# Altium schematic sheet Sensors_Actuators.SchDoc
size A4; SheetNumber: 3; SheetTotal: 3
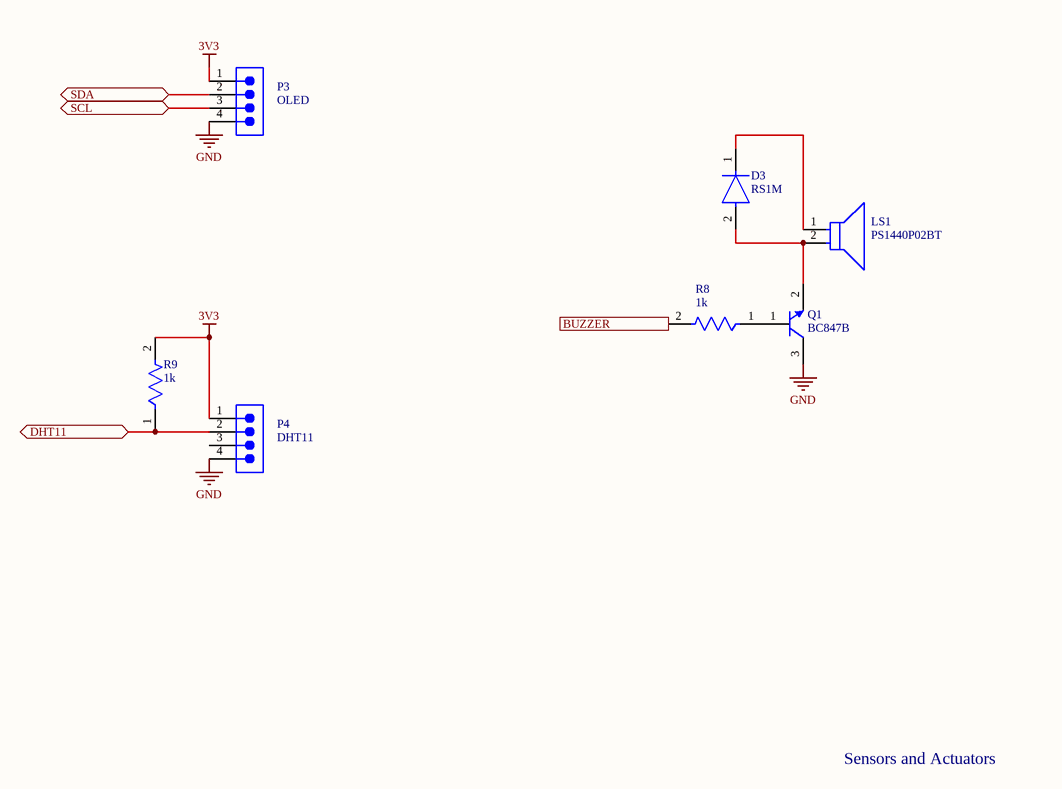
[diagram p0: Sensors_Actuators.SchDoc]

## Parts
D3  RS1M  [FP-403AE-MFG]
LS1  PS1440P02BT  [FP-PS1440P02BT-MFG]
P3  OLED  [61300411121]
P4  DHT11  [61300411121]
Q1  BC847B  [INF-SOT23_M]
R8  1k  [FP-CRCW1206-e3-MFG]
R9  1k  [FP-CRCW1206-e3-MFG]

## Ports
BUZZER (in, see Microcontroller[2B]), DHT11 (bidir, see Microcontroller[2B]), SCL (bidir, see Microcontroller[2B]), SDA (bidir, see Microcontroller[2B])

## Nets
3V3: P3.1 P4.1 R9.2
GND: P3.4 P4.4 Q1.3(C)
BUZZER: R8.2 ; port BUZZER
DHT11: P4.2 R9.1 ; port DHT11
SCL: P3.3 ; port SCL
SDA: P3.2 ; port SDA
NetD3_1: D3.1(C) LS1.1
NetD3_2: D3.2(A) LS1.2 Q1.2(E)
NetQ1_1: Q1.1(B) R8.1

Not connected (* = marked no-connect by the designer): P4 3

## Notes on the sheet
- Sensors and Actuators

## Library data of the parts
D3 = CMP-07163-000022-1: DIODE GEN PURP 1KV 1A SMA; Manufacturer: ON Semiconductor; Max Surge Forward Current: 30A; Max Repetitive Reverse Voltage: 1000V; Value: 10pF; Max Junction Temp: +150°C; Peak Reverse Current: 5uA; Standoff Height: 0.05mm; ComponentLink2URL: https://www.onsemi.com/pub/Collateral/RS1M-D.PDF; Footprint Url: https://www.onsemi.com/pub/Collateral/403AE.PDF; Mouser Description: On a Reel of 7500, ON Semi 1000V 1A, Diode, 2-Pin DO-214AC RS1M; Package: 403AE; Manufacturer Part Number: RS1M; Temperature Range Low: -55°C; Device Class L1: Discrete Semiconductors; Automotive: No; Height: 2.5mm; Octopart: https://octopart.com/rs1m-on+semiconductor-84331238; Digikey Description: DIODE GEN PURP 1KV 1A SMA; Temperature Range High: +150°C; Capacitance: 10pF; RoHS: TRUE; Device Class L2: Diodes; ComponentLink2Description: Datasheet; Temperature: -55°C to +150°C; Device Class L3: Rectifier Diodes; Forward Current: 1A; Lead Free: Yes; Category: Diode
LS1 = CMP-08413-000003-1: AUDIO PIEZO TRANSDUCER 30V TH; Self Resonant Frequency: 4kHz; Washable: No; Voltage Rating (DC): 3V; Number of Terminals/Pins: 2; Packaging: Tape and Reel; Lead Free: Lead Free; Min Operating Temperature: -10°C; Package Quantity: 350; Termination: PC Pins; Mount: Through Hole; Max Operating Temperature: 70°C; Operating Supply Voltage: 3V; Diameter: 14mm; RoHS Compliant: Yes; Frequency: 4kHz; Height: 8mm
P3 P4 = CMP-1502-01064-3: NexarPartId: 32855522; Operating Supply Voltage: 250V; Pitch: 2.54mm; Contact Resistance: 20mΩ; Number of Positions: 4; Current Rating: 3A; Connector Type: Male Pin; Gender: Male; Contact Plating: Gold; Height: 8.89mm; Lead Pitch: 2.54mm; Lead Free: Lead Free; Contact Mating Length: 5.9944mm; Number of Rows: 1; Termination: Solder; Packaging: Bulk; REACH SVHC: Unknown; Min Operating Temperature: -40°C; RoHS: Compliant; Number of Contacts: 4; Voltage Rating: 250V; Color: Black; Max Operating Temperature: 105°C; Contact Material: Copper; Mount: Through Hole; Orientation: Vertical; Number of Pins: 4
Q1 = CMP-1177-00042-1: NPN Silicon AF Transistor, 45 V VCEO, 100 mA IC, SOT23, Reel, Green; Manufacturer: Infineon; VEBO (max): 6Â V; ICBO (max): 15Â nA; VCBO (max): 50Â V; IBM (max): 200Â mA; Green: TRUE; Ptot (max): 330Â mW; fT (typ): 250Â MHz; IC (max): 100Â mA; VCEO (max): 45Â V; PackageDescription: 3-Pin Small Outline Transistor Package, 1.3 x 2.9 mm Body, 0.95 mm Pitch; ComponentLink3URL: http://www.infineon.com/dgdl/SOT23-Package_Overview.pdf?folderId=db3a30431936bc4b0119532290053c66&fileId=db3a30431936bc4b0119533468123c85; PackageVersion: Apr-08; Packing: Reel; ComponentLink3Description: Package Specification; ComponentLink2URL: http://www.infineon.com/dgdl/bc847series_bc848series_bc849series_bc850series.pdf?folderId=db3a304314dca389011541d30fa21656&fileId=db3a304314dca389011541d4630a1657; ComponentLink1URL: http://www.infineon.com/; ComponentLink2Description: Datasheet; Polarity: NPN; Mounting Technology: Surface Mount; PackageReference: SOT23; ICM (max): 200Â mA; ComponentLink1Description: Manufacturer URL; PartNumber: BC847B
R8 R9 = CMP-2003-01876-2: RES Thick Film, 1.2kΩ, 1%, 0.25W, 100ppm/°C, 1206; Voltage Rating (DC): 200V; Power Rating: 250mW; Resistance: 1.2kR; Temperature Coefficient: 100ppm/°C; Features: Automotive AEC-Q200; Lead Free: Lead Free; Termination: SMD/SMT; Composition: Thick Film; Length: 3.2mm; Width: 0.063inch; Case Code (Imperial): 1206; Contact Plating: Tin; Number of Terminations: 2; Height: 0.55mm; Depth: 1.6mm; Max Operating Temperature: 155°C; Tolerance: 1%; Case/Package: 1206; Voltage Rating: 200V; Case Code (Metric): 3216; Packaging: Tape and Reel; Weight: 0.000353oz; Package Quantity: 10; Max Power Dissipation: 250mW; Min Operating Temperature: -55°C; Working Voltage: 200V; Radiation Hardening: No; Military Standard: Not